# Altium schematic sheet PLC1.SchDoc
size 420 x 297 mm; Author: Тертычный; DrawnBy: Тертычный; SheetNumber: 1; SheetTotal: 2; Scale: {Масш.}; Title1str: {Наименование}; PageSetup: Record=PageOptions|CenterHorizontal=False|CenterVertical=False|PrintScale=0.67|XCorrection=0.00|YCorrection=0.00|PrintKind=1|BorderSize=5000000|LeftOffset=0|BottomOffset=0|Orientation=2|PaperLength=2970|PaperWidth=2100|Scale=100|PaperSource=7|PrintQuality=600|MediaType=1|DitherType=10|PaperKind=A4|PrintScaleMode=1; Title2str: {Наименование}; Mass: {Масса}; Letter1Column: {}; Letter2Column: {}; Letter3Column: {}; DocumentType: Панель индикации; DocumentType1str: {Документ}; DocumentType2str: {Документ}
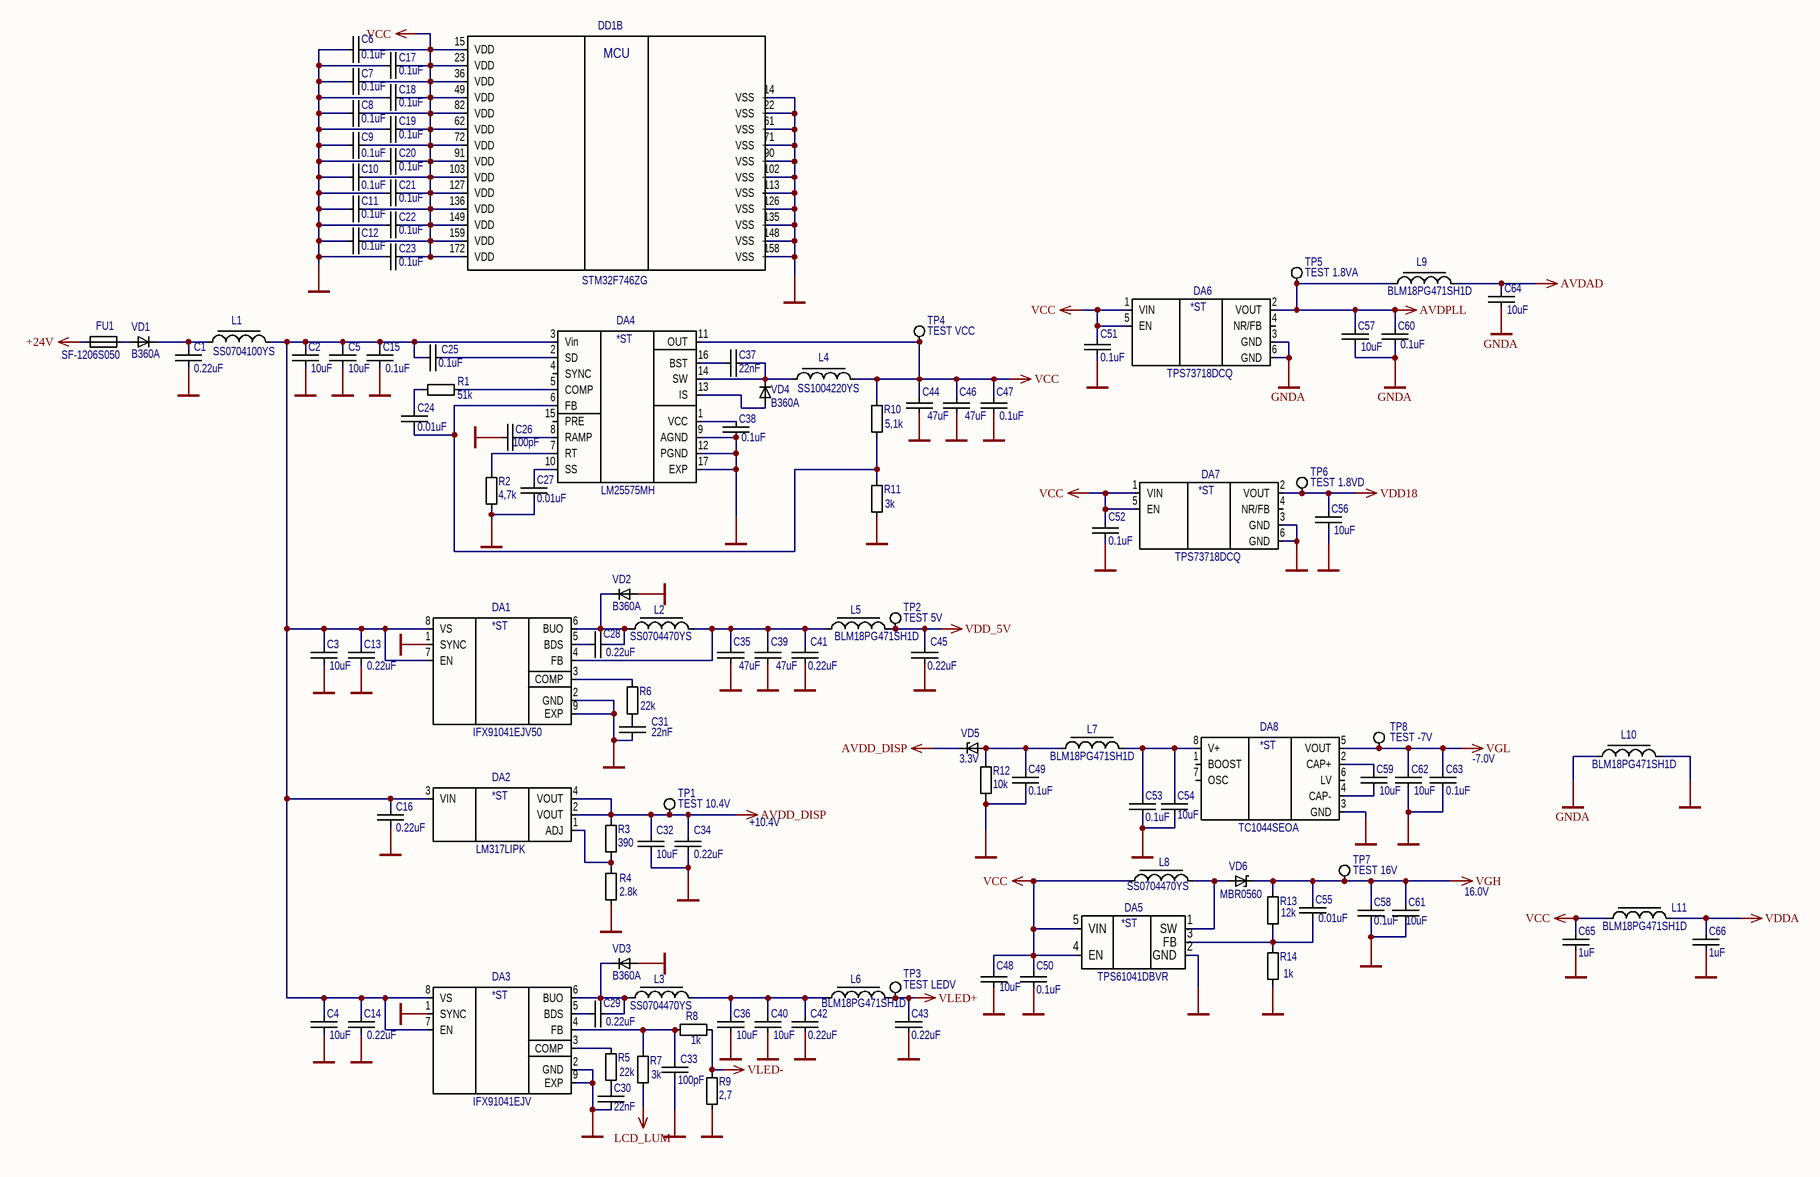
[diagram p0: PLC1.SchDoc]

## Parts
C1  value 0.22uF  [C_0805]  (hidden comment: Cap_0805)
C2  value 10uF  [CAP1210]  (hidden comment: Cap_1210)
C3  value 10uF  [CAP1210]  (hidden comment: Cap_1210)
C4  value 10uF  [CAP1210]  (hidden comment: Cap_1210)
C5  value 10uF  [CAP1210]  (hidden comment: Cap_1210)
C6  0.1uF  [CAP_0603]
C7  0.1uF  [CAP_0603]
C8  0.1uF  [CAP_0603]
C9  0.1uF  [CAP_0603]
C10  0.1uF  [CAP_0603]
C11  0.1uF  [CAP_0603]
C12  0.1uF  [CAP_0603]
C13  value 0.22uF  [C_0805]  (hidden comment: Cap_0805)
C14  value 0.22uF  [C_0805]  (hidden comment: Cap_0805)
C15  0.1uF  [C_0805]
C16  value 0.22uF  [C_0805]  (hidden comment: Cap_0805)
C17  0.1uF  [CAP_0603]
C18  0.1uF  [CAP_0603]
C19  0.1uF  [CAP_0603]
C20  0.1uF  [CAP_0603]
C21  0.1uF  [CAP_0603]
C22  0.1uF  [CAP_0603]
C23  0.1uF  [CAP_0603]
C24  0.01uF  [CAP_0603]
C25  0.1uF  [C_0805]
C26  value 100pF  [CAP_0603]  (hidden comment: 100p)
C27  value 0.01uF  [CAP_0603]  (hidden comment: 0.1uF)
C28  value 0.22uF  [C_0805]  (hidden comment: Cap_0805)
C29  value 0.22uF  [C_0805]  (hidden comment: Cap_0805)
C30  22nF  [CAP_0603]
C31  22nF  [CAP_0603]
C32  value 10uF  [CAP1210]  (hidden comment: Cap_1210)
C33  value 100pF  [CAP_0603]  (hidden comment: 100p)
C34  value 0.22uF  [C_0805]  (hidden comment: Cap_0805)
C35  value 47uF  [CAP1206]  (hidden comment: 1206)
C36  value 10uF  [CAP1210]  (hidden comment: Cap_1210)
C37  22nF  [CAP_0603]
C38  0.1uF  [CAP_0603]
C39  value 47uF  [CAP1206]  (hidden comment: 1206)
C40  value 10uF  [CAP1210]  (hidden comment: Cap_1210)
C41  value 0.22uF  [C_0805]  (hidden comment: Cap_0805)
C42  value 0.22uF  [C_0805]  (hidden comment: Cap_0805)
C43  value 0.22uF  [C_0805]  (hidden comment: Cap_0805)
C44  value 47uF  [CAP1206]  (hidden comment: 1206)
C45  value 0.22uF  [C_0805]  (hidden comment: Cap_0805)
C46  value 47uF  [CAP1206]  (hidden comment: 1206)
C47  0.1uF  [CAP_0603]
C48  10uF  [C_0805]
C49  0.1uF  [CAP_0603]
C50  0.1uF  [CAP_0603]
C51  0.1uF  [CAP_0603]
C52  0.1uF  [CAP_0603]
C53  0.1uF  [CAP_0603]
C54  value 10uF  [C_0805]  (hidden comment: Cap_0805)
C55  0.01uF  [CAP_0603]
C56  value 10uF  [C_0805]  (hidden comment: Cap_0805)
C57  value 10uF  [C_0805]  (hidden comment: Cap_0805)
C58  0.1uF  [CAP_0603]
C59  value 10uF  [C_0805]  (hidden comment: Cap_0805)
C60  0.1uF  [CAP_0603]
C61  value 10uF  [CAP1210]  (hidden comment: Cap_1210)
C62  value 10uF  [C_0805]  (hidden comment: Cap_0805)
C63  0.1uF  [CAP_0603]
C64  value 10uF  [C_0805]  (hidden comment: Cap_0805)
C65  1uF  [CAP_0603]
C66  1uF  [CAP_0603]
DA1  IFX91041EJV50  [SO-G8/E3]
DA2  LM317LIPK  [SOT-89]
DA3  IFX91041EJV50  [SO-G8/E3]  (value not drawn)
DA4  LM25575MH  [HTSSO5x6-G16]
DA5  Part Number: TPS61041DBVR  [SOT23-5]  (hidden comment: TPS61041)
DA6  TPS73718DCQ  [SOT-223-6]
DA7  TPS73718DCQ  [SOT-223-6]
DA8  TC1044SEOA  [SOIC8]
DD1  Part Number: STM32F746ZG  [F-QFP24x24-G176/N]  (hidden comment: STM32F746ZG_176)  (part B of 2)
FU1  g  [Res_1206]  (value not drawn)
L1  SS0704100YS  [SS0704]
L2  SS0704470YS  [SS0704]
L3  SS0704470YS  [SS0704]
L4  value SS1004220YS  [SS1004]  (hidden comment: SS1004100YS)
L5  BLM18PG471SH1D  [R_IND_0603]
L6  BLM18PG471SH1D  [R_IND_0603]
L7  BLM18PG471SH1D  [R_IND_0603]
L8  value SS0704470YS  [SS0704]  (hidden comment: SS0704100YS)
L9  BLM18PG471SH1D  [R_IND_0603]
L10  BLM18PG471SH1D  [R_IND_0603]
L11  BLM18PG471SH1D  [R_IND_0603]
R1  51k  [RES_0603]
R2  4,7k  [Res_0603]
R3  390  [RES_0603]
R4  2.8k  [RES_0603]
R5  22k  [RES_0603]
R6  22k  [RES_0603]
R7  3k  [RES_0603]
R8  1k  [RES_0603]
R9  2,7  [RES_0603]
R10  value 5,1k  [RES_0603]  (hidden comment: 5.1k)
R11  3k  [RES_0603]
R12  10k  [RES_0603]
R13  12k  [RES_0603]
R14  1k  [RES_0603]
TP1  value TEST 10.4V  [TEST POINT]  (hidden comment: JUMPER)
TP2  value TEST 5V  [TEST POINT]  (hidden comment: JUMPER)
TP3  value TEST LEDV  [TEST POINT]  (hidden comment: JUMPER)
TP4  value TEST VCC  [TEST POINT]  (hidden comment: JUMPER)
TP5  value TEST 1.8VA  [TEST POINT]  (hidden comment: JUMPER)
TP6  value TEST 1.8VD  [TEST POINT]  (hidden comment: JUMPER)
TP7  value TEST 16V  [TEST POINT]  (hidden comment: JUMPER)
TP8  value TEST -7V  [TEST POINT]  (hidden comment: JUMPER)
VD1  B360A  [DO-214AC]
VD2  B360A  [DO-214AC]
VD3  B360A  [DO-214AC]
VD4  B360A  [DO-214AC]
VD5  3.3V  [SOD-123]
VD6  MBR0560  [SOD-123]

## Nets
+24V: FU1.1
AVDAD: C64.2 L9.1
AVDD_DISP: C32.2 C34.2 DA2.2(VOUT) DA2.4(VOUT) R3.1 TP1.1 VD5.2
AVDPLL: C57.2 C60.1 DA6.2(VOUT) L9.2 TP5.1
GND: C1.1 C2.1 C3.1 C4.1 C5.1 C6.1 C7.2 C8.1 C9.2 C10.1 C11.1 C12.1 C13.1 C14.1 C15.2 C16.1 C17.1 C18.2 C19.2 C20.1 C21.2 C22.1 C23.1 C26.2 C27.1 C30.1 C31.1 C32.1 C33.2 C34.1 C35.1 C36.1 C38.2 C39.1 C40.1 C41.1 C42.1 C43.1 C44.1 C45.1 C46.1 C47.1 C48.1 C49.1 C50.1 C51.1 C52.1 C53.1 C54.1 C56.1 C58.1 C61.1 C62.1 C63.1 C65.1 C66.1 DA1.1(SYNC) DA1.2(GND) DA1.9(EXP) DA3.1(SYNC) DA3.2(GND) DA3.9(EXP) DA4.9(AGND) DA4.12(PGND) DA4.17(EXP) DA5.2(GND) DA7.3(GND) DA7.6(GND) DA8.3(GND) DD1.14(VSS) DD1.22(VSS) DD1.61(VSS) DD1.71(VSS) DD1.90(VSS) DD1.102(VSS) DD1.113(VSS) DD1.126(VSS) DD1.135(VSS) DD1.148(VSS) DD1.158(VSS) L10.1 R2.1 R4.2 R9.2 R11.1 R12.2 R14.2 VD2.1 VD3.1
GNDA: C57.1 C60.2 C64.1 DA6.3(GND) DA6.6(GND) L10.2
LCD_LUM: R7.1
VCC: C6.2 C7.1 C8.2 C9.1 C10.2 C11.2 C12.2 C17.2 C18.1 C19.1 C20.2 C21.1 C22.2 C23.2 C44.2 C46.2 C47.2 C48.2 C50.2 C51.2 C52.2 C65.2 DA4.11(OUT) DA5.4(EN) DA5.5(VIN) DA6.1(VIN) DA6.5(EN) DA7.1(VIN) DA7.5(EN) DD1.15(VDD) DD1.23(VDD) DD1.36(VDD) DD1.49(VDD) DD1.62(VDD) DD1.72(VDD) DD1.82(VDD) DD1.91(VDD) DD1.103(VDD) DD1.127(VDD) DD1.136(VDD) DD1.149(VDD) DD1.159(VDD) DD1.172(VDD) L4.1 L8.2 L11.2 R10.2 TP4.1
VDD18: C56.2 DA7.2(VOUT) TP6.1
VDD_5V: C45.2 L5.1 TP2.1
VDDA: C66.2 L11.1
VGH: C55.2 C58.2 C61.2 R13.1 TP7.1 VD6.2
VGL: C62.2 C63.2 DA8.5(VOUT) TP8.1
VLED+: C43.2 L6.1 TP3.1
VLED-: R8.2 R9.1
NetC1_2: C1.2 L1.2 VD1.2
NetC2_2: C2.2 C3.2 C4.2 C5.2 C13.2 C14.2 C15.1 C16.2 C25.2 DA1.7(EN) DA1.8(VS) DA2.3(VIN) DA3.7(EN) DA3.8(VS) DA4.3(Vin) L1.1
NetC24_1: C24.1 DA4.6(FB) R10.1 R11.2
NetC24_2: C24.2 R1.1
NetC25_1: C25.1 DA4.2(SD)
NetC26_1: C26.1 DA4.8(RAMP)
NetC27_2: C27.2 DA4.10(SS)
NetC28_1: C28.1 DA1.6(BUO) L2.2 VD2.2
NetC28_2: C28.2 DA1.5(BDS)
NetC29_1: C29.1 DA3.6(BUO) L3.2 VD3.2
NetC29_2: C29.2 DA3.5(BDS)
NetC30_2: C30.2 R5.1
NetC31_2: C31.2 R6.1
NetC33_1: C33.1 DA3.4(FB) R7.2 R8.1
NetC35_2: C35.2 C39.2 C41.2 DA1.4(FB) L2.1 L5.2
NetC36_2: C36.2 C40.2 C42.2 L3.1 L6.2
NetC37_1: C37.1 DA4.16(BST)
NetC37_2: C37.2 DA4.14(SW) L4.2 VD4.2
NetC38_1: C38.1 DA4.1(VCC)
NetC49_2: C49.2 L7.2 R12.1 VD5.1
NetC53_2: C53.2 C54.2 DA8.8(V+) L7.1
NetC55_1: C55.1 DA5.3(FB) R13.2 R14.1
NetC59_1: C59.1 DA8.4(CAP-)
NetC59_2: C59.2 DA8.2(CAP+)
NetDA1_3: DA1.3(COMP) R6.2
NetDA2_1: DA2.1(ADJ) R3.2 R4.1
NetDA3_3: DA3.3(COMP) R5.2
NetDA4_5: DA4.5(COMP) R1.2
NetDA4_7: DA4.7(RT) R2.2
NetDA4_13: DA4.13(IS) VD4.1
NetDA5_1: DA5.1(SW) L8.1 VD6.1
NetFU1_2: FU1.2 VD1.1

Not connected (* = marked no-connect by the designer): DA4 4(SYNC) 15(PRE); DA6 4(NR/FB); DA7 4(NR/FB); DA8 1(BOOST) 6(LV) 7(OSC)

## Notes on the sheet
- (near C63) -7.0V
- +10.4V
- 16.0V
- Перв. примен.
- Справ. №
- Подп. и дата
- Инв. № дубл.
- Взам. инв. №
- Разраб.
- Изм.
- Лист
- № докум.
- Подп.
- Дата
- Лит.
- Масса
- Масштаб
- Пров.
- Т.контр.
- Листов
- Инв. № подл.
- Утв.
- Н.контр.
- 2.106-A3
- Копировал
- Формат А3
- (in symbol IFX91041EJV33) *ST
- (in symbol LM317LIPK) *ST
- (in symbol LM25575MH) *ST
- (in symbol TC1044SEOA) *ST
- (in symbol TPS61041) *ST
- (in symbol TPS73718DCQ) *ST

## Library data of the parts
C1 C16 C34 = Cap_0805: Manufacturer: KEMET; Part Number: C0805C224K5RACTU; Replacement: 0805 X7R 50V 0.22uF; Price: 0.01$
C2 C5 C32 C61 = Cap_1210: Manufacturer: MURATA; Part Number: GRM31CR61H106KA12L; Replacement: 1210 10uF X5R or X7R 50V; PackageReference: 1210; Distributor: http://chipdip.ru/; Price: 0.2$
C3 C4 C36 C40 = Cap_1210: Manufacturer: MURATA; Part Number: GRM31CR61H106KA12L; Replacement: 1210 10uF X5R or X7R; PackageReference: 1210; Distributor: http://chipdip.ru/; Price: 0.2$
C6-C12 C17-C23 = Cap_0603: Manufacturer: AVX; Part Number: 0603YC104KAT2A; Replacement: GRM188R71E104KA12D; PackageReference: 0603; Value: 0.1uF; Distributor: http://www.rospek.ru; Price: 0.001$
C13 C14 C28 C29 C41-C43 C45 = Cap_0805: Part Number: C0805C224K5RACTU; Replacement: 0805 X7R 50V 0.22uF
C15 C25 = Cap_0805: Manufacturer: KEMET; Part Number: C0805C104K5RACTU; Replacement: 0805 X7R 50V 0.22uF; PackageReference: 0805; Value: 0.1uF; Price: 0.001$
C24 C27 C55 = Cap_0603: Manufacturer: AVX; Part Number: 0603YC103KAT2A; Replacement: GRM188R71E103KA12D; PackageReference: 0603; Distributor: http://www.rospek.ru; Price: 0.001$
  C24 C55: Value: 0.01uF
C26 C33 = Cap_0603: Manufacturer: Yageo; Part Number: CC0603JRNPO9BN101; Replacement: 100pF 0603 NP0; PackageReference: 0603; Distributor: http://www.platan.ru/; Price: 0.02$
C30 C31 C37 = Cap_0603: 10% X7R 0603; Manufacturer: Yageo; Part Number: CC0603KRX7R9BB223; Replacement: 22 nF 50V X7R 10% 0603; PackageReference: 0603; Value: 22nF; Distributor: http://www.rospek.ru; Price: 0.01$
C35 C39 C44 C46 = Cap_1206: Manufacturer: Murata; Part Number: GRM31CR61A476KE15L; Replacement: 1206 47uF 10V X5R; PackageReference: 1206
C38 C47 C49-C53 C58 C60 C63 = Cap_0603: 16V 0.1uF 10% X7R; Manufacturer: AVX; Part Number: 0603YC104KAT2A; Replacement: 0.1uF 16V X7R 10% 0603; PackageReference: 0603; Value: 0.1uF; Distributor: http://www.rospek.ru; Price: 0.001$
C48 C54 C56 C57 C59 C62 C64 = Cap_0805: Manufacturer: Murata; Part Number: GRM21BR61E106KA73L; Replacement: 0805 16V X7R; PackageReference: 0805; Price: 0.01$
  C48: Value: 10uF
C65 C66 = Cap_0603: Manufacturer: AVX; Part Number: 0603YC105KAT2A; Replacement: 0603YD105KAT2A; PackageReference: 0603; Value: 1uF; Distributor: http://www.rospek.ru; Price: 0.001$
DA1 = IFX91041EJV33: Manufacturer: Infenion; Price: 1.0$; Distributor: infenion.com; Replacement: IFX91041EJV50; PackageReference: PG-DSO-8-27; Part Number: IFX91041EJV50
DA2 = LM317LIPK: Manufacturer: Texas Instruments; Price: 0.1$; Distributor: TI; Replacement: LM317LIPK; PackageReference: SOT-89; Part Number: LM317LIPK
DA3 = IFX91041EJV33: IFX91041EJV; Manufacturer: Infenion; Replacement: IFX91041EJV ADJUST; Price: 0.78$; Distributor: infenion.com; PackageReference: PG-DSO-8-27; Part Number: IFX91041EJV
DA4 = LM25575MH: Manufacturer: Infenion; Replacement: LM25575QMHX; Price: 3.0$; Distributor: infenion.com; PackageReference: HTSSOP-16; Part Number: LM25575MH
DA5 = TPS61041: TPS61041 step-Up; Manufacturer: Texas Instruments; Price: 04$; Distributor: http://www.compel.ru/; PackageReference: SOT-23-5
DA6 DA7 = TPS73718DCQ: Manufacturer: Texas Instruments; Price: 0.1$; Distributor: TI; Replacement: TPS73718DCQ; PackageReference: SOT-89; Part Number: TPS73718DCQ
DA8 = TC1044SEOA: Manufacturer: MICROCHIP; Price: 0.7$; Distributor: chipdip.ru; Replacement: TC1044SEOA; PackageReference: SOIC-8; Part Number: TC1044SEOA
DD1 = STM32F746ZG_176: MCU; Manufacturer: ST; Price: 15$; Distributor: mouser; Replacement: STM32F746; PackageReference: LQFP144
FU1 = SF-1206S050: Fuse 0.5A; Manufacturer: Bourns; Replacement: 1206 fuse 0.5A; Part Number: SF-1206S050
L1 L8 = SS0704100YS: Manufacturer: ABC; Replacement: 10uH SS070; Part Number: SS0704100YS; Distributor: http://www.chipdip.ru; Price: 1$
  L1: Value: SS0704100YS
L2 L3 = SS0704100YS: Manufacturer: ABC; Replacement: 47uH SS070; Part Number: SS0704470YS; Distributor: http://www.chipdip.ru; Price: 1$; Value: SS0704470YS
L4 = SS1004470YS: Manufacturer: ABC; Replacement: 22uH; PackageReference: SS1004; Part Number: SS1004220YS; Distributor: http://www.chipdip.ru; Price: 1$
L5-L7 L9-L11 = FCM1608KF-601T03: Manufacturer: Murata; Replacement: 600 ohm @100 MHz; PackageReference: 0603; Part Number: BLM18PG471SH1D; Distributor: http://www.chipdip.ru; Price: 0.1$; Value: BLM18PG471SH1D
R1 = Res_0603: 0603, 51k; Manufacturer: Vishay; Part Number: CRCW0603-513JRT1; Replacement: 0603 51 kOhm 5%; PackageReference: 0603; Distributor: http://www.kontest.ru; Price: 0.01$
R2 = Res_0603: 0603, 100; Manufacturer: Vishay; Part Number: CRCW0603-472JRT1; Replacement: 0603 4.7 kOhm 5%; PackageReference: 0603; Value: 4,7k; Distributor: http://www.kontest.ru; Price: 0.01$
R3 = Res_0603: 0603, 390; Manufacturer: Vishay; Part Number: CRCW0603390RFKEA; Replacement: 0603 390 1%; PackageReference: 0603; Value: 390; Price: 0.004$
R4 = Res_0603: 0603, 390; Manufacturer: Vishay; Part Number: CRCW06032K80FKTA; Replacement: 0603 2.8k 1%; PackageReference: 0603; Value: 2.8k; Price: 0.004$
R5 R6 = Res_0603: 0603; Manufacturer: Yageo; Part Number: RC0603JR-0722K; Replacement: 0603 22 kOhm 5%; PackageReference: 0603; Distributor: http://www.kontest.ru; Price: 0.01$; Value: 22k
R7 R11 = Res_0603: 0603; Manufacturer: Yageo; Part Number: RC0603FR-073KL; Replacement: 0603 3 kOhm 1%; PackageReference: 0603; Distributor: http://www.kontest.ru; Price: 0.01$; Value: 3k
R8 R14 = Res_0603: 0603; Manufacturer: VKING; Part Number: RC0603FR-071KL; Replacement: 0603 1 kOhm 1%; PackageReference: 0603; Value: 1k; Distributor: http://www.kontest.ru; Price: 0.001$
R9 = Res_0805: 0603 2.7 Ohm 1% 0.125W; Manufacturer: Vishay; Part Number: CR0603-J/-2R7GLF; Replacement: 2.7 Ohm 0603; Value: 2.7; PackageReference: 0603; Distributor: http://www.kontest.ru; Price: 0.01$
R10 = Res_0603: 0603, 5.1k; Manufacturer: Yageo; Part Number: RC0603JR-075K1L; Replacement: 0603 5.1 kOhm 1%; PackageReference: 0603; Distributor: http://www.kontest.ru; Price: 0.01$
R12 = Res_0603: 0603, 10k; Manufacturer: Vishay; Part Number: CRCW060310K0JNE; Replacement: 0603 10 kOhm 5%; PackageReference: 0603; Distributor: http://www.kontest.ru; Price: 0.01$; Value: 10k
R13 = Res_0603: 0603; Manufacturer: Vishay; Part Number: CRCW060312K0FKEA; Replacement: 0603 12 kOhm 1%; PackageReference: 0603; Value: 12k; Distributor: http://www.kontest.ru; Price: 0.001$
TP1-TP8 = TEST_POINT_SMALL: JUMPER 2.54; Manufacturer: TE; Price: 0.05$
VD1-VD4 = S1A: Manufacturer: VISHAY; Price: 3; Distributor: http://www.chipdip.ru/; Part Number: B360A; PackageReference: DO-214AC
VD5 = BZT52-C3V3S: Price: 0.2$; Distributor: http://www.chipdip.ru/; Part Number: BZT52-C3V3S; PackageReference: SOD-223; Replacement: BZT52-C3V3S
VD6 = MBR0560: Price: 0.2$; Distributor: http://www.chipdip.ru/; Part Number: MBR0560; Replacement: MBR0560; PackageReference: SOD-123